# EAGLE design Adafruit CharlieWing (EAGLE 6.6.0)
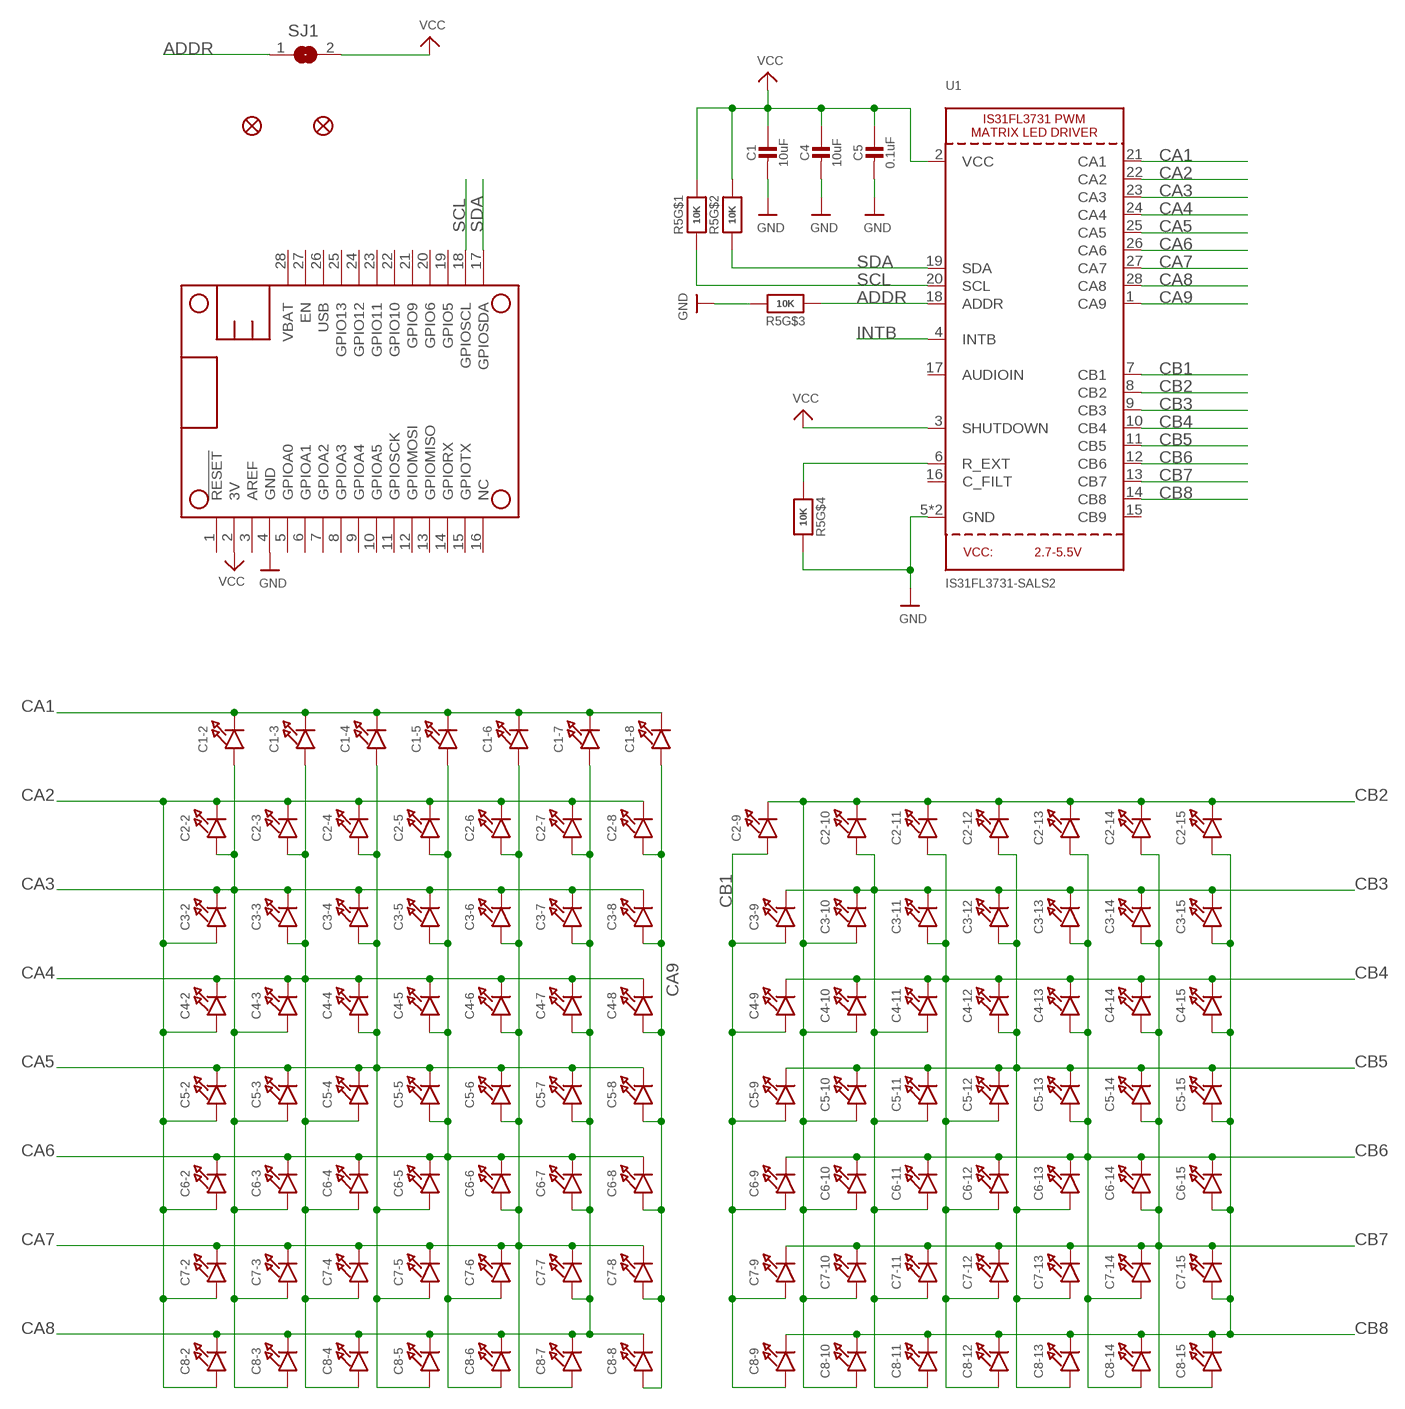
[diagram p0: schematic, sheet 1]

## Parts
C1  10uF  CAP_CERAMIC0805-NOOUTLINE  [0805-NO]
C1-2  LED0603_NOOUTLINE  [CHIPLED_0603_NOOUTLINE]
C1-3  LED0603_NOOUTLINE  [CHIPLED_0603_NOOUTLINE]
C1-4  LED0603_NOOUTLINE  [CHIPLED_0603_NOOUTLINE]
C1-5  LED0603_NOOUTLINE  [CHIPLED_0603_NOOUTLINE]
C1-6  LED0603_NOOUTLINE  [CHIPLED_0603_NOOUTLINE]
C1-7  LED0603_NOOUTLINE  [CHIPLED_0603_NOOUTLINE]
C1-8  LED0603_NOOUTLINE  [CHIPLED_0603_NOOUTLINE]
C2-2  LED0603_NOOUTLINE  [CHIPLED_0603_NOOUTLINE]
C2-3  LED0603_NOOUTLINE  [CHIPLED_0603_NOOUTLINE]
C2-4  LED0603_NOOUTLINE  [CHIPLED_0603_NOOUTLINE]
C2-5  LED0603_NOOUTLINE  [CHIPLED_0603_NOOUTLINE]
C2-6  LED0603_NOOUTLINE  [CHIPLED_0603_NOOUTLINE]
C2-7  LED0603_NOOUTLINE  [CHIPLED_0603_NOOUTLINE]
C2-8  LED0603_NOOUTLINE  [CHIPLED_0603_NOOUTLINE]
C2-9  LED0603_NOOUTLINE  [CHIPLED_0603_NOOUTLINE]
C2-10  LED0603_NOOUTLINE  [CHIPLED_0603_NOOUTLINE]
C2-11  LED0603_NOOUTLINE  [CHIPLED_0603_NOOUTLINE]
C2-12  LED0603_NOOUTLINE  [CHIPLED_0603_NOOUTLINE]
C2-13  LED0603_NOOUTLINE  [CHIPLED_0603_NOOUTLINE]
C2-14  LED0603_NOOUTLINE  [CHIPLED_0603_NOOUTLINE]
C2-15  LED0603_NOOUTLINE  [CHIPLED_0603_NOOUTLINE]
C3-2  LED0603_NOOUTLINE  [CHIPLED_0603_NOOUTLINE]
C3-3  LED0603_NOOUTLINE  [CHIPLED_0603_NOOUTLINE]
C3-4  LED0603_NOOUTLINE  [CHIPLED_0603_NOOUTLINE]
C3-5  LED0603_NOOUTLINE  [CHIPLED_0603_NOOUTLINE]
C3-6  LED0603_NOOUTLINE  [CHIPLED_0603_NOOUTLINE]
C3-7  LED0603_NOOUTLINE  [CHIPLED_0603_NOOUTLINE]
C3-8  LED0603_NOOUTLINE  [CHIPLED_0603_NOOUTLINE]
C3-9  LED0603_NOOUTLINE  [CHIPLED_0603_NOOUTLINE]
C3-10  LED0603_NOOUTLINE  [CHIPLED_0603_NOOUTLINE]
C3-11  LED0603_NOOUTLINE  [CHIPLED_0603_NOOUTLINE]
C3-12  LED0603_NOOUTLINE  [CHIPLED_0603_NOOUTLINE]
C3-13  LED0603_NOOUTLINE  [CHIPLED_0603_NOOUTLINE]
C3-14  LED0603_NOOUTLINE  [CHIPLED_0603_NOOUTLINE]
C3-15  LED0603_NOOUTLINE  [CHIPLED_0603_NOOUTLINE]
C4  10uF  CAP_CERAMIC0805-NOOUTLINE  [0805-NO]
C4-2  LED0603_NOOUTLINE  [CHIPLED_0603_NOOUTLINE]
C4-3  LED0603_NOOUTLINE  [CHIPLED_0603_NOOUTLINE]
C4-4  LED0603_NOOUTLINE  [CHIPLED_0603_NOOUTLINE]
C4-5  LED0603_NOOUTLINE  [CHIPLED_0603_NOOUTLINE]
C4-6  LED0603_NOOUTLINE  [CHIPLED_0603_NOOUTLINE]
C4-7  LED0603_NOOUTLINE  [CHIPLED_0603_NOOUTLINE]
C4-8  LED0603_NOOUTLINE  [CHIPLED_0603_NOOUTLINE]
C4-9  LED0603_NOOUTLINE  [CHIPLED_0603_NOOUTLINE]
C4-10  LED0603_NOOUTLINE  [CHIPLED_0603_NOOUTLINE]
C4-11  LED0603_NOOUTLINE  [CHIPLED_0603_NOOUTLINE]
C4-12  LED0603_NOOUTLINE  [CHIPLED_0603_NOOUTLINE]
C4-13  LED0603_NOOUTLINE  [CHIPLED_0603_NOOUTLINE]
C4-14  LED0603_NOOUTLINE  [CHIPLED_0603_NOOUTLINE]
C4-15  LED0603_NOOUTLINE  [CHIPLED_0603_NOOUTLINE]
C5  0.1uF  CAP_CERAMIC0805-NOOUTLINE  [0805-NO]
C5-2  LED0603_NOOUTLINE  [CHIPLED_0603_NOOUTLINE]
C5-3  LED0603_NOOUTLINE  [CHIPLED_0603_NOOUTLINE]
C5-4  LED0603_NOOUTLINE  [CHIPLED_0603_NOOUTLINE]
C5-5  LED0603_NOOUTLINE  [CHIPLED_0603_NOOUTLINE]
C5-6  LED0603_NOOUTLINE  [CHIPLED_0603_NOOUTLINE]
C5-7  LED0603_NOOUTLINE  [CHIPLED_0603_NOOUTLINE]
C5-8  LED0603_NOOUTLINE  [CHIPLED_0603_NOOUTLINE]
C5-9  LED0603_NOOUTLINE  [CHIPLED_0603_NOOUTLINE]
C5-10  LED0603_NOOUTLINE  [CHIPLED_0603_NOOUTLINE]
C5-11  LED0603_NOOUTLINE  [CHIPLED_0603_NOOUTLINE]
C5-12  LED0603_NOOUTLINE  [CHIPLED_0603_NOOUTLINE]
C5-13  LED0603_NOOUTLINE  [CHIPLED_0603_NOOUTLINE]
C5-14  LED0603_NOOUTLINE  [CHIPLED_0603_NOOUTLINE]
C5-15  LED0603_NOOUTLINE  [CHIPLED_0603_NOOUTLINE]
C6-2  LED0603_NOOUTLINE  [CHIPLED_0603_NOOUTLINE]
C6-3  LED0603_NOOUTLINE  [CHIPLED_0603_NOOUTLINE]
C6-4  LED0603_NOOUTLINE  [CHIPLED_0603_NOOUTLINE]
C6-5  LED0603_NOOUTLINE  [CHIPLED_0603_NOOUTLINE]
C6-6  LED0603_NOOUTLINE  [CHIPLED_0603_NOOUTLINE]
C6-7  LED0603_NOOUTLINE  [CHIPLED_0603_NOOUTLINE]
C6-8  LED0603_NOOUTLINE  [CHIPLED_0603_NOOUTLINE]
C6-9  LED0603_NOOUTLINE  [CHIPLED_0603_NOOUTLINE]
C6-10  LED0603_NOOUTLINE  [CHIPLED_0603_NOOUTLINE]
C6-11  LED0603_NOOUTLINE  [CHIPLED_0603_NOOUTLINE]
C6-12  LED0603_NOOUTLINE  [CHIPLED_0603_NOOUTLINE]
C6-13  LED0603_NOOUTLINE  [CHIPLED_0603_NOOUTLINE]
C6-14  LED0603_NOOUTLINE  [CHIPLED_0603_NOOUTLINE]
C6-15  LED0603_NOOUTLINE  [CHIPLED_0603_NOOUTLINE]
C7-2  LED0603_NOOUTLINE  [CHIPLED_0603_NOOUTLINE]
C7-3  LED0603_NOOUTLINE  [CHIPLED_0603_NOOUTLINE]
C7-4  LED0603_NOOUTLINE  [CHIPLED_0603_NOOUTLINE]
C7-5  LED0603_NOOUTLINE  [CHIPLED_0603_NOOUTLINE]
C7-6  LED0603_NOOUTLINE  [CHIPLED_0603_NOOUTLINE]
C7-7  LED0603_NOOUTLINE  [CHIPLED_0603_NOOUTLINE]
C7-8  LED0603_NOOUTLINE  [CHIPLED_0603_NOOUTLINE]
C7-9  LED0603_NOOUTLINE  [CHIPLED_0603_NOOUTLINE]
C7-10  LED0603_NOOUTLINE  [CHIPLED_0603_NOOUTLINE]
C7-11  LED0603_NOOUTLINE  [CHIPLED_0603_NOOUTLINE]
C7-12  LED0603_NOOUTLINE  [CHIPLED_0603_NOOUTLINE]
C7-13  LED0603_NOOUTLINE  [CHIPLED_0603_NOOUTLINE]
C7-14  LED0603_NOOUTLINE  [CHIPLED_0603_NOOUTLINE]
C7-15  LED0603_NOOUTLINE  [CHIPLED_0603_NOOUTLINE]
C8-2  LED0603_NOOUTLINE  [CHIPLED_0603_NOOUTLINE]
C8-3  LED0603_NOOUTLINE  [CHIPLED_0603_NOOUTLINE]
C8-4  LED0603_NOOUTLINE  [CHIPLED_0603_NOOUTLINE]
C8-5  LED0603_NOOUTLINE  [CHIPLED_0603_NOOUTLINE]
C8-6  LED0603_NOOUTLINE  [CHIPLED_0603_NOOUTLINE]
C8-7  LED0603_NOOUTLINE  [CHIPLED_0603_NOOUTLINE]
C8-8  LED0603_NOOUTLINE  [CHIPLED_0603_NOOUTLINE]
C8-9  LED0603_NOOUTLINE  [CHIPLED_0603_NOOUTLINE]
C8-10  LED0603_NOOUTLINE  [CHIPLED_0603_NOOUTLINE]
C8-11  LED0603_NOOUTLINE  [CHIPLED_0603_NOOUTLINE]
C8-12  LED0603_NOOUTLINE  [CHIPLED_0603_NOOUTLINE]
C8-13  LED0603_NOOUTLINE  [CHIPLED_0603_NOOUTLINE]
C8-14  LED0603_NOOUTLINE  [CHIPLED_0603_NOOUTLINE]
C8-15  LED0603_NOOUTLINE  [CHIPLED_0603_NOOUTLINE]
FID1  FIDUCIAL""  [FIDUCIAL_1MM]
FID2  FIDUCIAL""  [FIDUCIAL_1MM]
MS1  FEATHERWING  [FEATHERWING]
R5  10K  RESISTOR_4PACK  [RESPACK_4X0603]
SJ1  SOLDERJUMPER  [SOLDERJUMPER_ARROW_NOPASTE]
U1  IS31FL3731-SALS2  IS31FL3731QFN  [QFN28_4MM_0.4MM]

## Nets
ADDR: R5.3 SJ1.1 U1.18(ADDR)
CA1: C1-2.C C1-3.C C1-4.C C1-5.C C1-6.C C1-7.C C1-8.C U1.21(CA1)
CA2: C2-2.C C2-3.C C2-4.C C2-5.C C2-6.C C2-7.C C2-8.C C3-2.A C4-2.A C5-2.A C6-2.A C7-2.A C8-2.A U1.22(CA2)
CA3: C1-2.A C2-2.A C3-2.C C3-3.C C3-4.C C3-5.C C3-6.C C3-7.C C3-8.C C4-3.A C5-3.A C6-3.A C7-3.A C8-3.A U1.23(CA3)
CA4: C1-3.A C2-3.A C3-3.A C4-2.C C4-3.C C4-4.C C4-5.C C4-6.C C4-7.C C4-8.C C5-4.A C6-4.A C7-4.A C8-4.A U1.24(CA4)
CA5: C1-4.A C2-4.A C3-4.A C4-4.A C5-2.C C5-3.C C5-4.C C5-5.C C5-6.C C5-7.C C5-8.C C6-5.A C7-5.A C8-5.A U1.25(CA5)
CA6: C1-5.A C2-5.A C3-5.A C4-5.A C5-5.A C6-2.C C6-3.C C6-4.C C6-5.C C6-6.C C6-7.C C6-8.C C7-6.A C8-6.A U1.26(CA6)
CA7: C1-6.A C2-6.A C3-6.A C4-6.A C5-6.A C6-6.A C7-2.C C7-3.C C7-4.C C7-5.C C7-6.C C7-7.C C7-8.C C8-7.A U1.27(CA7)
CA8: C1-7.A C2-7.A C3-7.A C4-7.A C5-7.A C6-7.A C7-7.A C8-2.C C8-3.C C8-4.C C8-5.C C8-6.C C8-7.C C8-8.C U1.28(CA8)
CA9: C1-8.A C2-8.A C3-8.A C4-8.A C5-8.A C6-8.A C7-8.A C8-8.A U1.1(CA9)
CB1: C2-9.A C3-9.A C4-9.A C5-9.A C6-9.A C7-9.A C8-9.A U1.7(CB1)
CB2: C2-9.C C2-10.C C2-11.C C2-12.C C2-13.C C2-14.C C2-15.C C3-10.A C4-10.A C5-10.A C6-10.A C7-10.A C8-10.A U1.8(CB2)
CB3: C2-10.A C3-9.C C3-10.C C3-11.C C3-12.C C3-13.C C3-14.C C3-15.C C4-11.A C5-11.A C6-11.A C7-11.A C8-11.A U1.9(CB3)
CB4: C2-11.A C3-11.A C4-9.C C4-10.C C4-11.C C4-12.C C4-13.C C4-14.C C4-15.C C5-12.A C6-12.A C7-12.A C8-12.A U1.10(CB4)
CB5: C2-12.A C3-12.A C4-12.A C5-9.C C5-10.C C5-11.C C5-12.C C5-13.C C5-14.C C5-15.C C6-13.A C7-13.A C8-13.A U1.11(CB5)
CB6: C2-13.A C3-13.A C4-13.A C5-13.A C6-9.C C6-10.C C6-11.C C6-12.C C6-13.C C6-14.C C6-15.C C7-14.A C8-14.A U1.12(CB6)
CB7: C2-14.A C3-14.A C4-14.A C5-14.A C6-14.A C7-9.C C7-10.C C7-11.C C7-12.C C7-13.C C7-14.C C7-15.C C8-15.A U1.13(CB7)
CB8: C2-15.A C3-15.A C4-15.A C5-15.A C6-15.A C7-15.A C8-9.C C8-10.C C8-11.C C8-12.C C8-13.C C8-14.C C8-15.C U1.14(CB8)
GND: C1.2 C4.2 C5.2 MS1.4(GND) R5.5 R5.6 U1.5(GND) U1.THERMAL(GND)
INTB: U1.4(INTB)
R_EXT: R5.4 U1.6(R_EXT)
SCL: MS1.18(GPIOSCL) R5.1 U1.20(SCL)
SDA: MS1.17(GPIOSDA) R5.2 U1.19(SDA)
VCC: C1.1 C4.1 C5.1 MS1.2(3V) R5.7 R5.8 SJ1.2 U1.2(VCC) U1.3(SHUTDOWN)
Unconnected: MS1.1(!RESET) MS1.3(AREF) MS1.5(GPIOA0) MS1.6(GPIOA1) MS1.7(GPIOA2) MS1.8(GPIOA3) MS1.9(GPIOA4) MS1.10(GPIOA5) MS1.11(GPIOSCK) MS1.12(GPIOMOSI) MS1.13(GPIOMISO) MS1.14(GPIORX) MS1.15(GPIOTX) MS1.16(NC) MS1.19(GPIO5) MS1.20(GPIO6) MS1.21(GPIO9) MS1.22(GPIO10) MS1.23(GPIO11) MS1.24(GPIO12) MS1.25(GPIO13) MS1.26(USB) MS1.27(EN) MS1.28(VBAT) U1.15(CB9) U1.16(C_FILT) U1.17(AUDIOIN)

## Library data of the parts
C1 C4 C5 = microbuilder:CAP_CERAMIC: Ceramic Capacitors For new designs, use the packages preceded by an '_' character since they are more reliable: The following footprints should be used on most boards: _0402 - Standard footprint for regular board layouts _0603 - Standard footprint for regular board layouts _0805 - Standard footprint for regular board layouts _1206 - Standard footprint for regular board layouts For extremely tight-pitch boards where space is at a premium, the following 'micro-pitch' footprints can be used (smaller pads, no silkscreen outline, etc.): _0402MP - Micro-pitch footprint for very dense/compact boards _0603MP - Micro-pitch footprint for very dense/compact boards _0805MP - Micro-pitch footprint for very dense/compact boards _1206MP - Micro-pitch footprint for very dense/compact boards
C1-2-C1-8 C2-2-C2-15 C3-2-C3-15 C4-2-C4-15 C5-2-C5-15 C6-2-C6-15 C7-2-C7-15 C8-2-C8-15 = microbuilder:LED: LED 0603 - 0603 Surface Mount Package 2mA: Green LED - Low Power (3.9mcd, 2ma, 1.7Vf) - Digikey: 475-2709-2-ND Orange LED - Low Power (9.8mcd, 2ma, 1.8Vf) - Digikey: 475-1194-2-ND Red LED - Low Power (5mcd, 2ma, 1.8Vf) - Digikey: 475-1195-2-ND Yellow LED - Low Power (7mcd, 2ma, 1.8Vf) - Digikey: 475-1196-2-ND 5mA: Blue LED - Low Power (17mcd, 5ma, 2.9Vf) - Digikey: LNJ937W8CRACT-ND 0805 - 0805 Surface Mount Package 2mA: Red LED (8.8mcd, 2mA, 1.8Vf, Clear) - Low Power [Digikey: 475-2510-1-ND] Green LED (5mcd, 2mA, 1.8Vf, Clear) - Low Power [Digikey: 475-2730-1-ND] Yellow LED (11.3mcd, 2mA, 1.8Vf, Clear) - Low Power [Digikey: 475-2555-1-ND] 20mA: Red LED (104mcd, 20mA, Diffused) - LS R976 [Digikey: 475-1278-6-ND] Red LED (12mcd, 20mA, 2.0Vf, Clear) - APT2012EC [Digikey: 754-1128-1-ND] Green LED (15mcd, 20mA, 2.2Vf, Clear) - APT2012GC [Digikey: 754-1131-1-ND] Orange LED (160mcd, 20mA, 2.1Vf, Clear) - APT2012SECK [Digikey: 754-1130-1-ND] 1206 - 1206 Surface Mount Package Green LED (26mcd, 20mA, Diffused) - LG N971 [Digikey: 475-1407-6-ND] Red LED (15mcd, 20mA, Diffused) - LH N974 [Digikey: 475-1416-6-ND] Cree - Cree High-Power Surface Mount LEDs XPEBWT-L1-0000-00D50 - White 111lm 350mA 2.9Vf 6200K 110° XTEAWT-00-0000-00000LEE3 - White 114lm 350mA 2.85Vf 5000K 115° Everlight - Everlight 45-21 Series Surface Mount LEDs 45-21/QK2C-B2832AC2CB2/2T - Warm White 2000mcd 20mA 3.25Vf 3050K 120° 45-21/LK2C-B38452C4CB2/2T - Nuetral White 2000mcd 20mA 3.25Vf 4150K 120° 45-21/LK2C-B50634C6CB2/2T - Cold White 2200mcd 20mA 3.25Vf 5650K 120° PLCC2 Reverse Mount LS T77K-J1L2-1-0-2-R18-Z - Red 11.25mcd 2mA 1.8Vf 630nm 120° LO T77K-L1M2-24-Z - Orange 19.6mcd 2mA 1.8Vf 606nm 120° LY T77K-K2M1-26-Z - Yellow 15.7mcd 2mA 1.8Vf 587nm 120°
FID1 FID2 = microbuilder:FIDUCIAL: Fiducial Alignment Points Various fiducial points for machine vision alignment.; BOM: EXCLUDE
MS1 = microbuilder:FEATHERWING
R5 = microbuilder:RESISTOR_4PACK: Resistor Packs (4 resistors) 4 x 0603 10K 1/16W - Digikey: YC164J-10KCT-ND
SJ1 = microbuilder:SOLDERJUMPER: SMD Solder JUMPER Solder the two pads together to create a connection, or remove the solder to break it. REFLOW - Use this footprint for solder paste and reflow ovens. WAVE - Use this footprint for hand-soldering (larger pads). CLOSED - Has a trace between the two pads to ensure it is closed by default. The trace needs to be cut to disable the jumper, and can be closed again by creating a solder bridge between the two pads.; BOM: EXCLUDE
U1 = microbuilder:IS31FL3731: IS31FL3731 PWM LED Matrix Driver

## Board
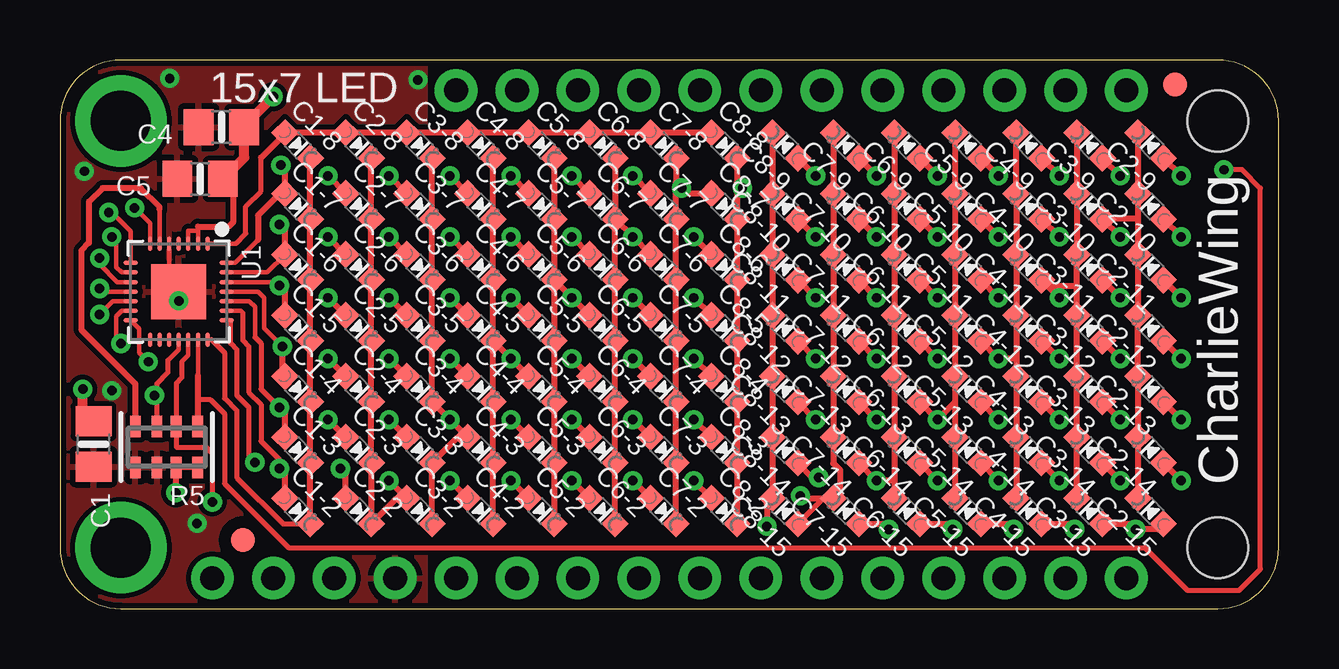
[diagram p1: board, top side]
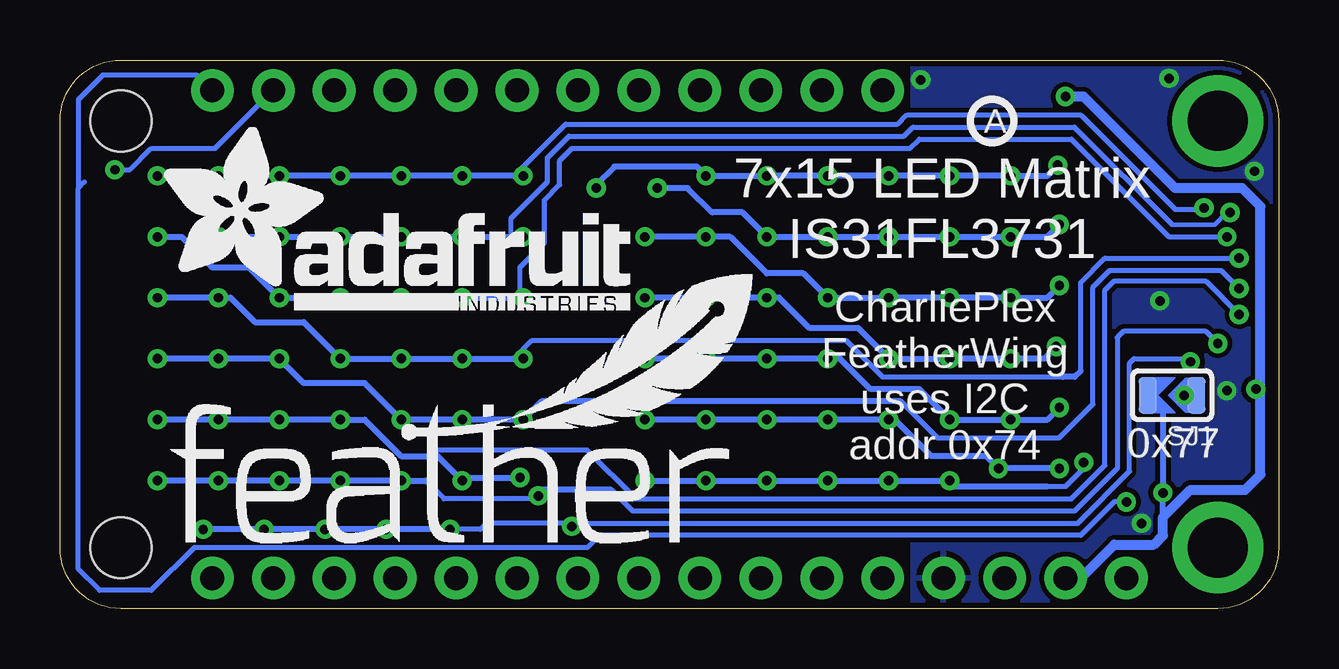
[diagram p2: board, bottom side, seen from below]

Size 50.8 x 22.86 mm. Coordinates in mm from the lower left corner, seen from the top.
Copper layers (1*16): Top 0.035mm / dielectric 1.5mm / Bottom 0.035mm
Design rules "adafruit *": minimum track width 7mil, minimum drill 15.5mil, track to track 8mil, track to pad 8mil, pad to pad 8mil, via to via 8mil, smd to smd 8mil, copper to edge 10mil, drill to drill 8mil, minimum pad ring 10mil, minimum via ring 8mil, stop-mask expansion 2mil, vias tented up to drill 20mil, thermal gap 10mil

### Footprints (pad centres in the part's own frame; a part is rotated, then mirrored left to right if it is on the bottom)
0805-NO = smd 1.24 x 1.5: 1 -0.95,0; 2 0.95,0
CHIPLED_0603_NOOUTLINE = smd 0.8 x 0.8: A 0,-0.75; C 0,0.75
FIDUCIAL_1MM = smd 1 x 1: 1 0,0
FEATHERWING = drill 1 pad 1.778: 1 6.35,1.27; 2 8.89,1.27; 3 11.43,1.27; 4 13.97,1.27; 5 16.51,1.27; 6 19.05,1.27; 7 21.59,1.27; 8 24.13,1.27; 9 26.67,1.27; 10 29.21,1.27; 11 31.75,1.27; 12 34.29,1.27; 13 36.83,1.27; 14 39.37,1.27; 15 41.91,1.27; 16 44.45,1.27; 17 44.45,21.59; 18 41.91,21.59; 19 39.37,21.59; 20 36.83,21.59; 21 34.29,21.59; 22 31.75,21.59; 23 29.21,21.59; 24 26.67,21.59; 25 24.13,21.59; 26 21.59,21.59; 27 19.05,21.59; 28 16.51,21.59 | drill 2.5 pad 3.81: P$1 2.54,20.32; P$2 2.54,2.54 | hole 2.54: 48.26,20.32; 48.26,2.54
RESPACK_4X0603 = smd 0.45 x 0.9: 1 -1.3,-0.85; 2 -0.4,-0.85; 3 0.4,-0.85; 4 1.3,-0.85; 5 1.3,0.85; 6 0.4,0.85; 7 -0.4,0.85; 8 -1.3,0.85
SOLDERJUMPER_ARROW_NOPASTE = smd 0.762 x 1.524: 1 -1.016,0; 2 1.016,0
QFN28_4MM_0.4MM = smd 0.6 x 0.18: 1 -2,1.2; 2 -2,0.8; 3 -2,0.4; 4 -2,0; 5 -2,-0.4; 6 -2,-0.8; 7 -2,-1.2; 15 2,-1.2; 16 2,-0.8; 17 2,-0.4; 18 2,0; 19 2,0.4; 20 2,0.8; 21 2,1.2 | smd 0.18 x 0.6: 8 -1.2,-2; 9 -0.8,-2; 10 -0.4,-2; 11 0,-2; 12 0.4,-2; 13 0.8,-2; 14 1.2,-2; 22 1.2,2; 23 0.8,2; 24 0.4,2; 25 0,2; 26 -0.4,2; 27 -0.8,2; 28 -1.2,2 | smd 2.3 x 2.3: THERMAL 0,0

### Placement (x,y rotation side)
C1  1.4,6.86 270 top
C1-2  9.91,4.06 225 top
C1-3  9.91,6.6 225 top
C1-4  9.91,9.14 225 top
C1-5  9.91,11.68 225 top
C1-6  9.91,14.22 225 top
C1-7  9.91,16.76 225 top
C1-8  9.91,19.3 225 top
C2-2  12.45,4.06 225 top
C2-3  12.45,6.6 225 top
C2-4  12.45,9.14 225 top
C2-5  12.45,11.68 225 top
C2-6  12.45,14.22 225 top
C2-7  12.45,16.76 225 top
C2-8  12.45,19.3 225 top
C2-9  45.47,19.3 45 top
C2-10  45.47,16.76 45 top
C2-11  45.47,14.22 45 top
C2-12  45.47,11.68 45 top
C2-13  45.47,9.14 45 top
C2-14  45.47,6.6 45 top
C2-15  45.47,4.06 45 top
C3-2  14.99,4.06 225 top
C3-3  14.99,6.6 225 top
C3-4  14.99,9.14 225 top
C3-5  14.99,11.68 225 top
C3-6  14.99,14.22 225 top
C3-7  14.99,16.76 225 top
C3-8  14.99,19.3 225 top
C3-9  42.93,19.3 45 top
C3-10  42.93,16.76 45 top
C3-11  42.93,14.22 45 top
C3-12  42.93,11.68 45 top
C3-13  42.93,9.14 45 top
C3-14  42.93,6.6 45 top
C3-15  42.93,4.06 45 top
C4  6.73,20.07 180 top
C4-2  17.53,4.06 225 top
C4-3  17.53,6.6 225 top
C4-4  17.53,9.14 225 top
C4-5  17.53,11.68 225 top
C4-6  17.53,14.22 225 top
C4-7  17.53,16.76 225 top
C4-8  17.53,19.3 225 top
C4-9  40.39,19.3 45 top
C4-10  40.39,16.76 45 top
C4-11  40.39,14.22 45 top
C4-12  40.39,11.68 45 top
C4-13  40.39,9.14 45 top
C4-14  40.39,6.6 45 top
C4-15  40.39,4.06 45 top
C5  5.84,17.91 180 top
C5-2  20.07,4.06 225 top
C5-3  20.07,6.6 225 top
C5-4  20.07,9.14 225 top
C5-5  20.07,11.68 225 top
C5-6  20.07,14.22 225 top
C5-7  20.07,16.76 225 top
C5-8  20.07,19.3 225 top
C5-9  37.85,19.3 45 top
C5-10  37.85,16.76 45 top
C5-11  37.85,14.22 45 top
C5-12  37.85,11.68 45 top
C5-13  37.85,9.14 45 top
C5-14  37.85,6.6 45 top
C5-15  37.85,4.06 45 top
C6-2  22.61,4.06 225 top
C6-3  22.61,6.6 225 top
C6-4  22.61,9.14 225 top
C6-5  22.61,11.68 225 top
C6-6  22.61,14.22 225 top
C6-7  22.61,16.76 225 top
C6-8  22.61,19.3 225 top
C6-9  35.31,19.3 45 top
C6-10  35.31,16.76 45 top
C6-11  35.31,14.22 45 top
C6-12  35.31,11.68 45 top
C6-13  35.31,9.14 45 top
C6-14  35.31,6.6 45 top
C6-15  35.31,4.06 45 top
C7-2  25.15,4.06 225 top
C7-3  25.15,6.6 225 top
C7-4  25.15,9.14 225 top
C7-5  25.15,11.68 225 top
C7-6  25.15,14.22 225 top
C7-7  25.15,16.76 225 top
C7-8  25.15,19.3 225 top
C7-9  32.77,19.3 45 top
C7-10  32.77,16.76 45 top
C7-11  32.77,14.22 45 top
C7-12  32.77,11.68 45 top
C7-13  32.77,9.14 45 top
C7-14  32.77,6.6 45 top
C7-15  32.77,4.06 45 top
C8-2  27.69,4.06 225 top
C8-3  27.69,6.6 225 top
C8-4  27.69,9.14 225 top
C8-5  27.69,11.68 225 top
C8-6  27.69,14.22 225 top
C8-7  27.69,16.76 225 top
C8-8  27.69,19.3 225 top
C8-9  30.23,19.3 45 top
C8-10  30.23,16.76 45 top
C8-11  30.23,14.22 45 top
C8-12  30.23,11.68 45 top
C8-13  30.23,9.14 45 top
C8-14  30.23,6.6 45 top
C8-15  30.23,4.06 45 top
FID1  7.62,2.86 0 top
FID2  46.48,21.84 0 top
MS1  0,0 0 top
R5  4.45,6.73 180 top
SJ1  4.45,8.89 180 bottom
U1  4.95,13.21 270 top
U$1  [PCBFEAT-REV-040]  11.94,20.32 0 bottom
U$2  [ADAFRUIT_TEXT_20MM]  46.61,12.45 0 bottom
U$6  [FEATHERLOGO]  46.23,2.67 0 bottom

### Tracks (layer width: path | path; a pad name or v marks a point on that pad's centre or on a via)
ADDR  (via drill 0.39)
  Top 0.178: U1.18 4.95,10.79 4.51,10.35 | v3.94,8.89 4.04,8.89
  Top 0.203: 4.51,10.35 4.51,9.84 4.04,9.38 4.04,8.89 R5.3
  Bottom 0.203: SJ1.1 v3.94,8.89
CA1
  Top 0.178: 6.32,11.21 U1.21
  Top 0.203: 6.32,11.21 6.86,10.67 6.86,8.76 7.37,8.26 7.37,5.46 9.29,3.53 C1-2.C
  Top 0.254: C1-2.C C1-3.C C1-4.C C1-5.C C1-6.C C1-7.C | C1-7.C C1-8.C 10.41,18.8 10.41,16.26 C1-7.C
CA2  (via drill 0.39)
  Top 0.178: U1.22 7.04,12.01 7.11,11.94 7.11,11.05
  Top 0.203: 7.11,11.05 7.37,10.79 7.37,8.89 7.87,8.38 7.87,6.35 v8.13,6.1
  Top 0.254: C2-8.C C2-7.C C2-6.C C2-5.C C2-4.C C2-3.C C2-2.C 14.02,4.57 14.43,4.57 C3-2.A v13.72,5.33 | C4-2.A v16.26,5.33 | C5-2.A v18.8,5.33 | C6-2.A v21.34,5.33 | C7-2.A v23.88,5.33 | C8-2.A v26.42,5.33
  Bottom 0.203: 9.65,5.08 8.89,5.08 8.13,5.84 v8.13,6.1
  Bottom 0.254: v26.42,5.33 v23.88,5.33 v21.34,5.33 v18.8,5.33 v16.26,5.33 v13.72,5.33 13.46,5.08 9.65,5.08
CA3  (via drill 0.39)
  Top 0.178: U1.23 7.53,12.41 7.62,12.32
  Top 0.203: 7.62,12.32 7.62,11.18 7.87,10.92 7.87,9.02 8.38,8.51 8.38,6.99 9.14,6.22 v9.14,5.84
  Top 0.254: C3-2.C C3-3.C 16.55,7.11 16.97,7.11 C4-3.A v16.26,7.87 C3-4.C C3-5.C C3-6.C C3-7.C C3-8.C | v26.42,7.87 C8-3.A | C7-3.A v23.88,7.87 | C6-3.A v21.34,7.87 | C5-3.A v18.8,7.87 | C2-2.A 11.92,5.61 v11.68,5.84 | C1-2.A 9.38,5.61 v9.14,5.84
  Bottom 0.254: v9.14,5.84 v11.68,5.84 12.19,6.35 14.48,6.35 16,7.87 v16.26,7.87 v18.8,7.87 v21.34,7.87 v23.88,7.87 v26.42,7.87
CA4  (via drill 0.39)
  Top 0.178: U1.24 7.89,12.81 8.13,12.57 8.13,11.3
  Top 0.203: 8.13,11.3 8.38,11.05 8.38,9.14 v9.14,8.38
  Top 0.254: C4-2.C C4-3.C C4-4.C C4-5.C | C4-5.C C4-6.C C4-7.C C4-8.C | v26.42,10.41 C8-4.A | C7-4.A v23.88,10.41 | C6-4.A v21.34,10.41 | C5-4.A v18.8,10.41 C4-5.C | v11.18,7.87 C2-3.A | C3-3.A v13.72,7.87 | C1-3.A 9.38,8.15 v9.14,8.38
  Bottom 0.254: v26.42,10.41 v23.88,10.41 v21.34,10.41 v18.8,10.41 18.29,10.41 17.02,9.14 14.99,9.14 v13.72,7.87 v11.18,7.87 9.65,7.87 v9.14,8.38
CA5  (via drill 0.39)
  Top 0.178: U1.25 8.26,13.21 8.51,12.95 8.51,11.68 v9.27,10.92
  Top 0.254: C5-8.C C5-7.C C5-6.C | C5-6.C C5-5.C C5-4.C C5-3.C C5-2.C | C4-4.A v16.26,10.41 | v13.72,10.41 C3-4.A | C2-4.A v11.18,10.41 | v26.42,12.95 C8-5.A | C7-5.A v23.88,12.95 | C6-5.A v21.34,12.95 C5-6.C | C1-4.A 9.27,9.78 v9.27,10.92
  Bottom 0.254: v26.42,12.95 v23.88,12.95 v21.34,12.95 20.83,12.95 19.56,11.68 17.53,11.68 v16.26,10.41 v13.72,10.41 v11.18,10.41 9.78,10.41 v9.27,10.92
CA6  (via drill 0.39)
  Top 0.178: U1.26 9,13.61
  Top 0.254: C6-8.C C6-7.C | C6-2.C C6-3.C C6-4.C C6-5.C C6-6.C C6-7.C | C5-5.A v18.8,12.95 | v16.26,12.95 C4-5.A | C3-5.A v13.72,12.95 | C2-5.A v11.18,12.95 | C7-6.A v23.88,15.49 C6-7.C | v26.42,15.49 C8-6.A | C1-5.A 9.38,13.23 v9.14,13.46 9,13.61
  Bottom 0.254: v26.42,15.49 v23.88,15.49 22.86,15.49 21.34,13.97 19.81,13.97 v18.8,12.95 v16.26,12.95 v13.72,12.95 v11.18,12.95 9.65,12.95 v9.14,13.46
CA7  (via drill 0.39)
  Top 0.178: U1.27 8.63,14.01 C1-6.A
  Top 0.254: C7-2.C C7-3.C C7-4.C C7-5.C C7-6.C C7-7.C 25.68,17.29 v25.91,17.53 | v11.18,15.49 C2-6.A | C3-6.A v13.72,15.49 | C4-6.A v16.26,15.49 | C5-6.A v18.8,15.49 | C6-6.A v21.34,15.49 | C7-8.C 25.68,17.76 v25.91,17.53 | C8-7.A 26.14,17.29 v25.91,17.53 | C1-6.A 9.38,15.77 v9.14,16
  Bottom 0.254: v25.91,17.53 24.64,17.53 23.62,16.51 22.35,16.51 v21.34,15.49 v18.8,15.49 v16.26,15.49 v13.72,15.49 v11.18,15.49 9.65,15.49 v9.14,16
CA8  (via drill 0.39)
  Top 0.178: 8.26,15.37 7.3,14.41 U1.28
  Top 0.203: 9.17,17.29 C1-7.A
  Top 0.254: C8-2.C C8-3.C C8-4.C C8-5.C C8-6.C C8-7.C C8-8.C 28.22,17.76 v28.45,17.53 | C7-7.A v23.88,18.03 | v21.34,18.03 C6-7.A | C5-7.A v18.8,18.03 | C4-7.A v16.26,18.03 | C3-7.A v13.72,18.03 | C2-7.A v11.18,18.03 | 9.17,17.29 8.26,16.38 8.26,15.37 | C1-7.A 9.38,18.31 v9.21,18.48
  Bottom 0.254: v28.45,17.53 28.45,17.65 27.69,18.41 24.26,18.41 v23.88,18.03 v21.34,18.03 v18.8,18.03 v16.26,18.03 v13.72,18.03 v11.18,18.03 9.65,18.03 v9.21,18.48
CA9
  Top 0.178: 7.33,15.21 U1.1
  Top 0.203: 7.33,15.21 7.75,15.62 7.75,16.76 8.38,17.4 8.38,18.8
  Top 0.254: C8-8.A C7-8.A C6-8.A C5-8.A C4-8.A C3-8.A C2-8.A C1-8.A 9.38,19.79 8.38,18.8
CB1  (via drill 0.39)
  Top 0.178: U1.7 3.75,16.06 v3.11,16.7
  Top 0.254: 46.02,18.8 C2-9.A v46.74,18.03 | v44.2,18.03 C3-9.A | C4-9.A v41.66,18.03 | C5-9.A v39.12,18.03 | C6-9.A v36.58,18.03 | C7-9.A v34.04,18.03 | C8-9.A v31.5,18.03
  Bottom 0.203: 31.88,18.03 29.72,20.19 15.88,20.19 15.49,20.57 8.26,20.57 4.32,16.64 3.17,16.64 v3.11,16.7
  Bottom 0.254: v46.74,18.03 v44.2,18.03 v41.66,18.03 v39.12,18.03 v36.58,18.03 v34.04,18.03 31.88,18.03 v31.5,18.03
CB2  (via drill 0.39)
  Top 0.178: U1.8 2.95,15.72 2.16,16.51 v2.03,16.51
  Top 0.254: C2-15.C C2-14.C C2-13.C C2-12.C C2-11.C 44.94,16.26 | C2-9.C C2-10.C 44.94,16.26 | 44.94,16.26 43.48,16.26 C3-10.A v44.2,15.49 | v31.5,15.49 C8-10.A | C7-10.A v34.04,15.49 | C6-10.A v36.58,15.49 | C5-10.A v39.12,15.49 | C4-10.A v41.66,15.49
  Bottom 0.178: 4.45,16 2.67,16 2.16,16.51 v2.03,16.51
  Bottom 0.203: 32,15.49 32,16.26 30.48,17.78 30.48,18.8 29.59,19.68 15.62,19.68 15.24,20.07 8.51,20.07 4.45,16
  Bottom 0.254: v31.5,15.49 32,15.49 v34.04,15.49 v36.58,15.49 v39.12,15.49 v41.66,15.49 v44.2,15.49
CB3  (via drill 0.39)
  Top 0.178: U1.9 2.57,14.01 2.35,14.22 2.35,15.3 v2.16,15.49
  Top 0.254: C3-15.C C3-14.C C3-13.C C3-12.C 42.4,13.46 | 42.4,13.46 C3-11.C C3-10.C C3-9.C | 42.4,13.46 41.15,13.46 C4-11.A v41.66,12.95 | v31.5,12.95 C8-11.A | C7-11.A v34.04,12.95 | C6-11.A v36.58,12.95 | C5-11.A v39.12,12.95 | C2-10.A v46.74,15.49
  Bottom 0.203: 31.62,12.95 31.62,14.22 30.61,15.24 30.61,17.02 29.97,17.65 29.97,18.67 29.46,19.18 15.37,19.18 14.99,19.56 8.64,19.56 4.57,15.49 v2.16,15.49
  Bottom 0.254: v31.5,12.95 31.62,12.95 v34.04,12.95 v36.58,12.95 v39.12,12.95 v41.66,12.95 42.93,14.22 44.45,14.22 45.72,15.49 v46.74,15.49
CB4  (via drill 0.39)
  Top 0.178: U1.10 2.39,13.61 1.65,14.35 v1.65,14.61
  Top 0.254: 39.86,10.52 C4-12.C C4-11.C C4-10.C C4-9.C | 39.86,10.52 C4-13.C C4-14.C C4-15.C | v46.74,12.95 C2-11.A | C3-11.A v44.2,12.95 | v31.5,10.41 C8-12.A | C7-12.A v34.04,10.41 | C6-12.A v36.58,10.41 | 39.86,10.52 39.75,10.41 v39.12,10.41 | C5-12.A v39.12,10.41 | v39.12,10.41
  Bottom 0.203: 31.88,10.41 31.11,11.18 18.03,11.18 16.51,9.65 9.02,9.65 | 8.26,9.91 8.26,13.59 7.24,14.61 v1.65,14.61
  Bottom 0.254: v46.74,12.95 v44.2,12.95 43.69,12.95 42.67,11.94 40.64,11.94 v39.12,10.41 v36.58,10.41 v34.04,10.41 31.88,10.41 v31.5,10.41 | 8.26,9.91 8.51,9.65 9.02,9.65
CB5  (via drill 0.39)
  Top 0.178: 3.05,13.21 U1.11 1.78,13.21 v1.65,13.34
  Top 0.254: C4-12.A v41.66,10.41 | C2-12.A v46.74,10.41 | C3-12.A v44.2,10.41 | C5-15.C C5-14.C 37.32,8.61 | 37.32,8.61 C5-13.C C5-12.C C5-11.C C5-10.C C5-9.C | v36.58,7.87 37.32,8.61 | C7-13.A v34.04,7.87 | C8-13.A v31.5,7.87 | C6-13.A v36.58,7.87 | v36.58,7.87
  Bottom 0.203: 15.75,8.64 14.22,7.11 9.14,7.11 7.75,8.51 7.75,13.4 7.05,14.1 2.41,14.1 v1.65,13.34
  Bottom 0.254: v46.74,10.41 v44.2,10.41 v41.66,10.41 40.64,9.4 38.1,9.4 v36.58,7.87 v34.04,7.87 v31.5,7.87 30.73,8.64 15.75,8.64
CB6  (via drill 0.39)
  Top 0.178: U1.12 2.2,12.81 v1.65,12.26 1.71,12.26
  Top 0.254: v46.74,7.87 C2-13.A | C3-13.A v44.2,7.87 | C4-13.A v41.66,7.87 | C6-9.C C6-10.C C6-11.C C6-12.C C6-13.C C6-14.C 34.78,5.33 | 34.78,5.33 C6-15.C | C7-14.A v34.04,5.33 34.78,5.33 | C5-13.A v39.12,7.87 | C8-14.A 31.37,5.46 v31.62,5.46
  Bottom 0.203: v1.65,12.26 3.05,13.65 6.86,13.65 7.24,13.27 7.24,5.97 8.64,4.57 26.8,4.57 28.83,6.6 35.05,6.6 35.31,6.35
  Bottom 0.254: v46.74,7.87 v44.2,7.87 v41.66,7.87 v39.12,7.87 38.1,7.87 36.58,6.35 35.31,6.35 35.05,6.35 v34.04,5.33 33.91,5.46 v31.62,5.46
CB7  (via drill 0.39)
  Top 0.178: U1.13 2.57,12.41 2.35,12.19 2.35,11.24 v2.54,11.05
  Top 0.203: C7-15.C 31.82,4.59 C8-15.A 30.99,3.77
  Top 0.254: C4-14.A v41.66,5.33 | C2-14.A v46.74,5.33 | C3-14.A v44.2,5.33 | C7-9.C C7-10.C C7-11.C C7-12.C C7-13.C C7-14.C 32.24,6.05 32.51,5.78 32.51,4.87 C7-15.C 30.97,4.59 v30.86,4.7 | C6-14.A v36.58,5.33 | v39.12,5.33 C5-14.A
  Bottom 0.203: v2.54,11.05 3.05,11.56 6.48,11.56 6.73,11.3 6.73,5.84 8.51,4.06 26.92,4.06 27.81,4.95 | 31.11,4.57 34.8,4.57 35.56,5.33
  Bottom 0.254: v46.74,5.33 v44.2,5.33 v41.66,5.33 v39.12,5.33 v36.58,5.33 35.56,5.33 | 27.81,4.95 30.73,4.95 30.86,4.83 v30.86,4.7 30.99,4.57 31.11,4.57
CB8  (via drill 0.39)
  Top 0.178: U1.14 3.3,11.66 3.3,10.67 v3.68,10.29
  Top 0.203: C8-15.C 29.59,4.49
  Top 0.254: C8-9.C C8-10.C C8-11.C C8-12.C C8-13.C C8-14.C C8-15.C 29.46,4.36 v29.46,3.43 | C7-15.A 34.31,3.53 v34.54,3.3 | C6-15.A 36.98,3.53 v37.21,3.3 | C5-15.A 39.52,3.53 v39.75,3.3 | C4-15.A 42.06,3.53 v42.29,3.3 | C3-15.A 44.6,3.53 v44.83,3.3 45.77,3.3 C2-15.A
  Bottom 0.203: v29.46,3.43 29.34,3.56 | 29.34,3.56 8.38,3.56 6.22,5.71 6.22,10.22 6.03,10.41 3.81,10.41 v3.68,10.29 | 29.34,3.56 33.02,3.56 33.27,3.3 v34.54,3.3
  Bottom 0.254: v44.83,3.3 v42.29,3.3 v39.75,3.3 v37.21,3.3 v34.54,3.3
GND  (via drill 0.39)
  Top 0.178: U1.5 4.55,13.61
  Top 0.203: 4.55,13.61 U1.THERMAL
  other vias: 2.16,9.08 5.71,3.56 4.95,12.83 1.02,18.22 4.57,22.1 14.92,22.03
  pour Top: 0,22.86 0,0 15.24,0 15.24,22.86
  pour Bottom: 0,22.86 0,0 15.24,0 15.24,22.86
R_EXT
  Top 0.178: U1.6 4.15,16.66
  Top 0.254: 4.15,16.66 4.15,16.74 3.37,17.53 1.78,17.53 1.21,16.95 1.21,15.24 0.89,14.92 0.89,11.62 3.15,9.36 R5.4
SCL  (via drill 0.39)
  Top 0.178: U1.20 5.75,9.72
  Top 0.203: v48.51,18.29 49.28,18.29 50.04,17.53 50.04,1.65 49.15,0.76 46.99,0.76 45.21,2.54 9.53,2.54 6.86,5.21 6.86,8.13 6.29,8.7 5.75,8.7 R5.1
  Top 0.254: 5.75,9.72 5.75,9.71 R5.1
  Bottom 0.203: v48.51,18.29 47.88,18.29 46.99,19.18 44.32,19.18 MS1.18
SDA  (via drill 0.39)
  Top 0.178: U1.19 5.35,10.56 5.08,10.29
  Top 0.203: 5.08,10.29 5.08,9.63 4.84,9.4 R5.2 4.84,6.73 6.1,6.73 6.35,6.48 v6.35,4.45
  Bottom 0.203: v6.35,4.45 6.86,4.45 8.26,3.05 28.32,3.05 28.83,2.54 45.21,2.54 46.99,0.76 49.15,0.76 50.04,1.65 50.04,17.53 | 50.04,17.53 49.78,17.78 | MS1.17 45.09,22.23 49.02,22.23 50.04,21.21 50.04,17.53
VCC  (via drill 0.39)
  Top 0.178: 5.75,15.91 5.75,15.75 | 5.75,15.75 U1.2 | U1.3 5.35,15.75 5.75,15.75
  Top 0.254: 5.75,15.91 7.02,15.91 7.24,16.13 7.24,17.46 C5.1 | R5.8 R5.7 4.97,5.88 4.98,5.87 4.83,5.71 v4.83,4.83
  Top 0.406: C1.1 0.95,8.25 v0.95,9.14 | v8.89,21.34 7.68,20.13 C4.1 7.68,18.8 C5.1
  Bottom 0.254: 4.83,3.81 v4.83,4.83 4.83,8.26 SJ1.2
  Bottom 0.406: MS1.2 8.26,1.27 6.86,2.67 5.21,2.67 4.83,3.05 4.83,3.81 3.68,4.95 1.4,4.95 0.76,5.59 0.76,9.14 | 0.76,9.14 0.76,16.76 1.52,17.53 4.32,17.53 8.13,21.34 v8.89,21.34 | 0.76,9.14 v0.95,9.14

### Text on the board
tPlace: 15x7 LED | CharlieWing
bPlace: 7x15 LED Matrix / IS31FL3731 | CharliePlex / FeatherWing / uses I2C / addr 0x74 | 0x77